# Altium schematic sheet MainBoard_RASP.SchDoc
size 594 x 420 mm; DocumentNumber: VSL.23-MOTHERBOARD; SheetNumber: 2; Format: A2
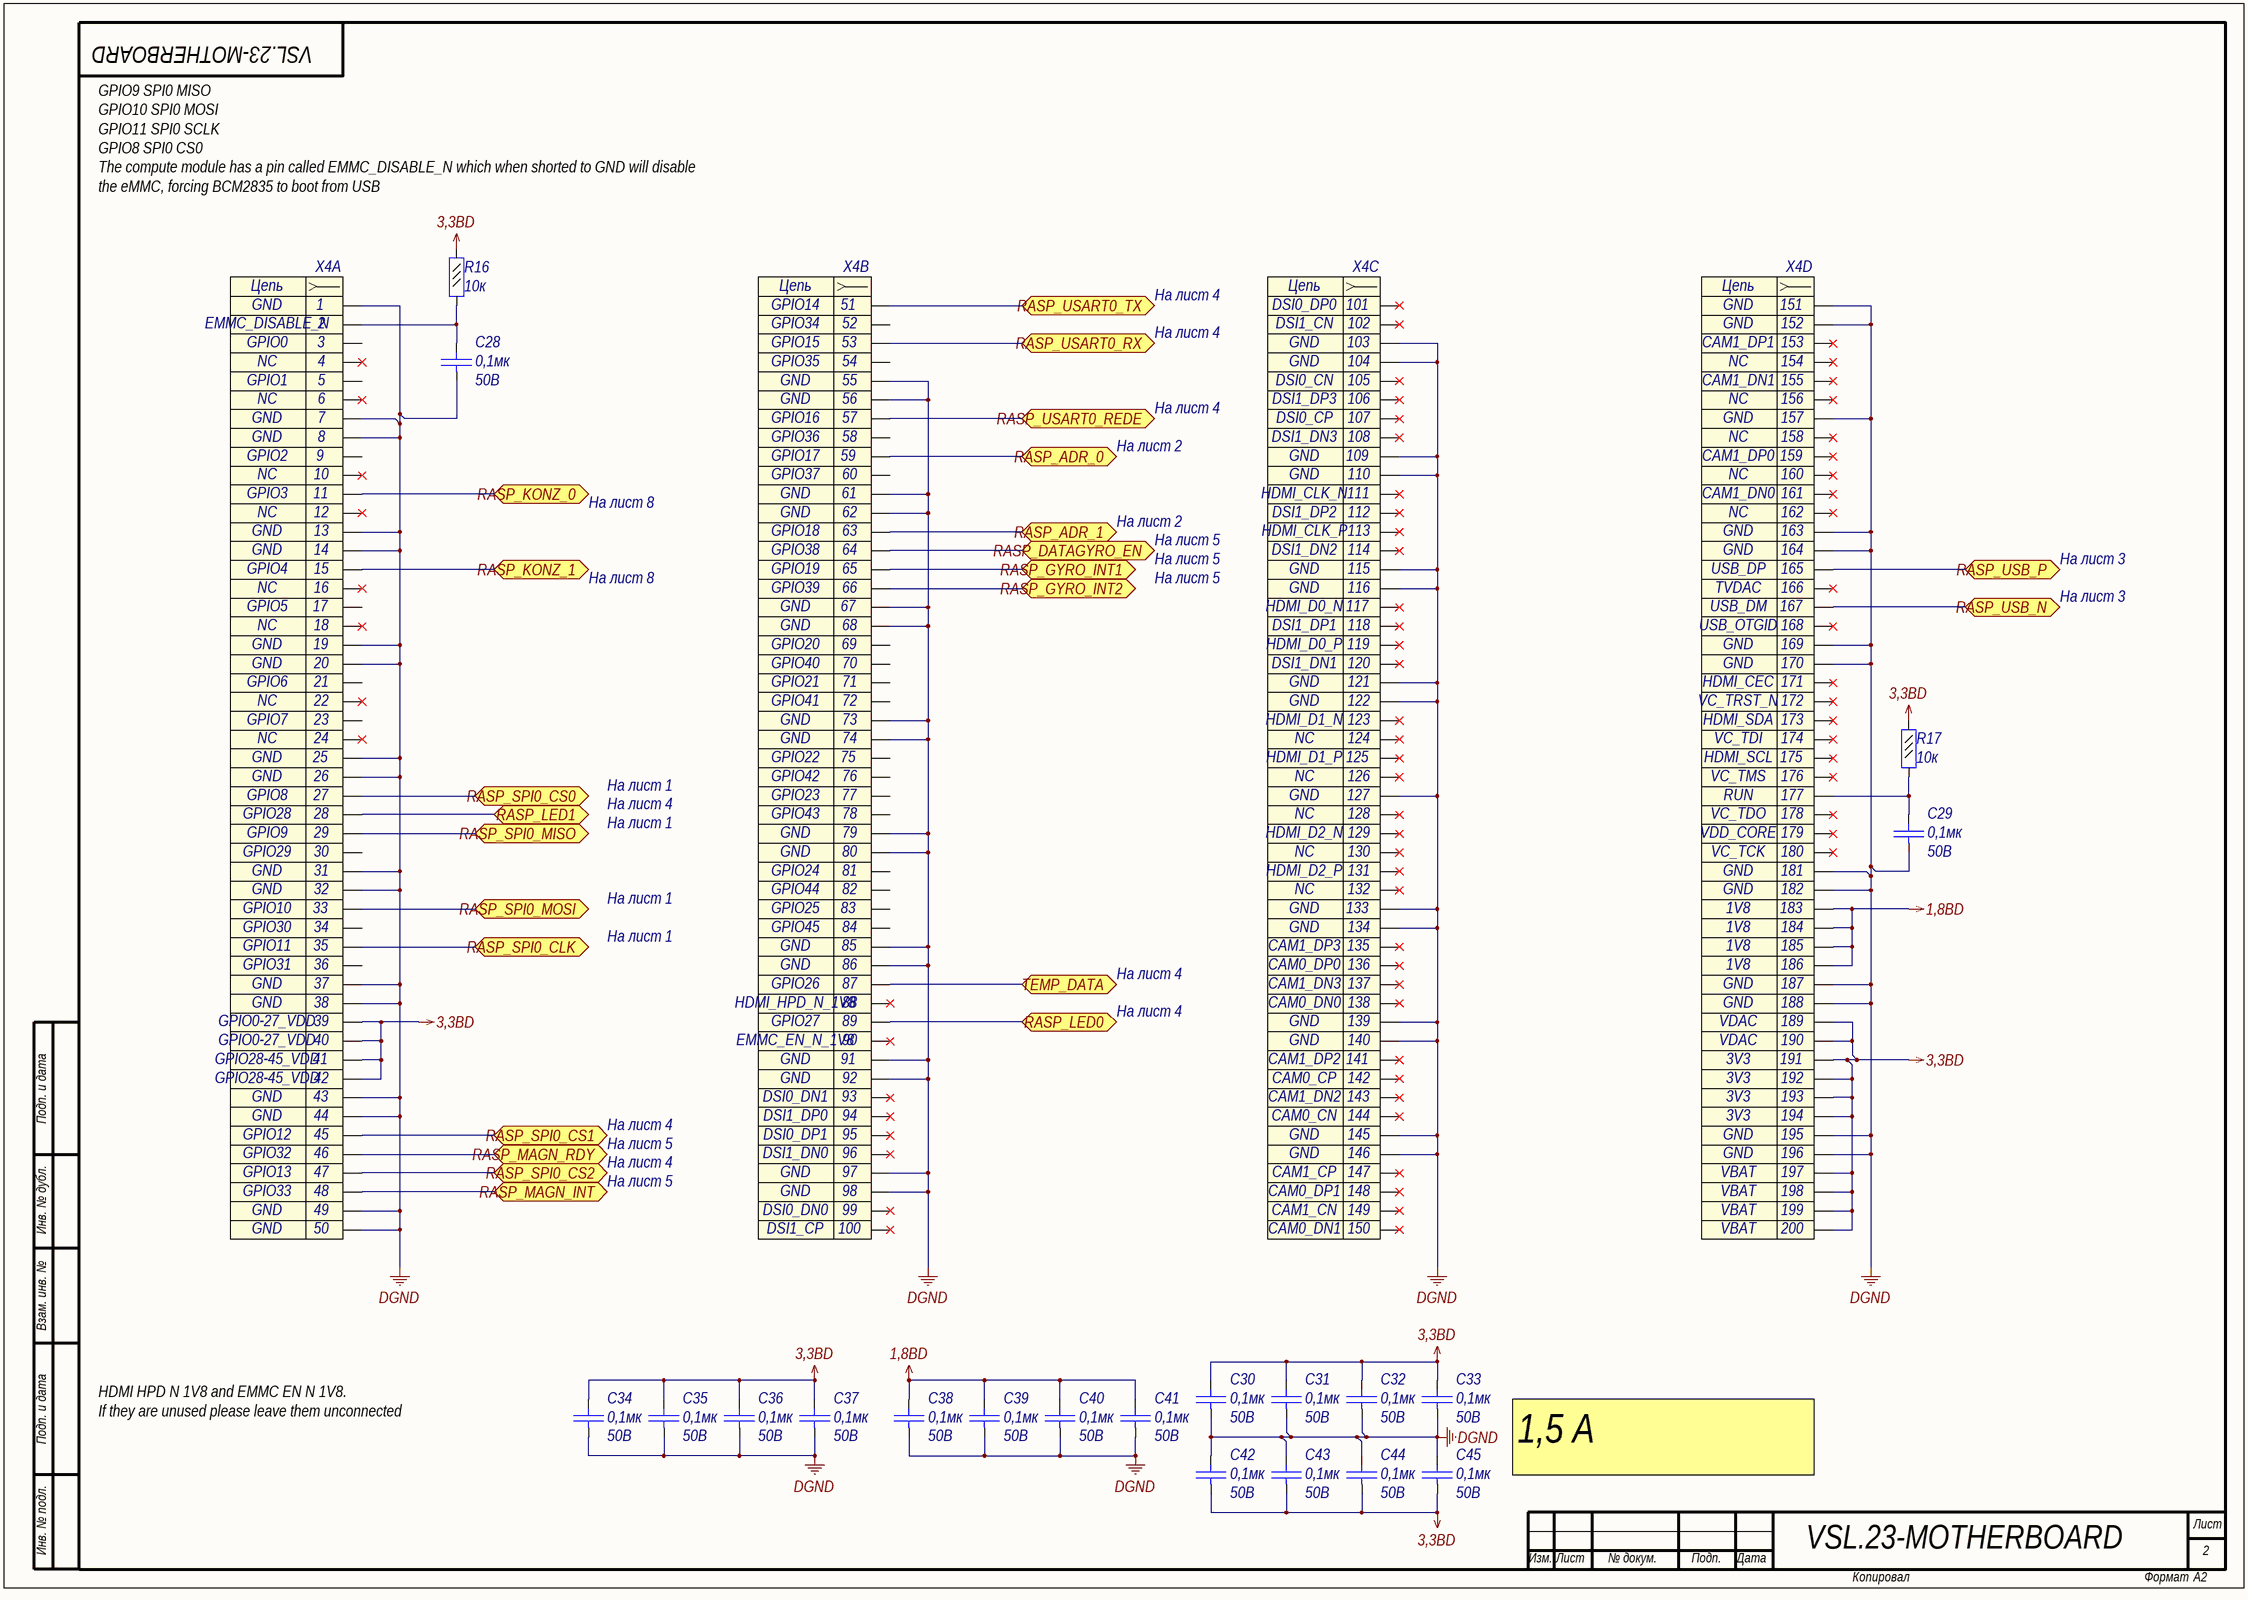
[diagram p0: MainBoard_RASP.SchDoc]

## Parts
C28  value 0,1мк  Voltage: 50B  [C0402]  (hidden comment: Capacitor)
C29  value 0,1мк  Voltage: 50B  [C0402]  (hidden comment: Capacitor)
C30  value 0,1мк  Voltage: 50B  [C0402]  (hidden comment: Capacitor)
C31  value 0,1мк  Voltage: 50B  [C0402]  (hidden comment: Capacitor)
C32  value 0,1мк  Voltage: 50B  [C0402]  (hidden comment: Capacitor)
C33  value 0,1мк  Voltage: 50B  [C0402]  (hidden comment: Capacitor)
C34  value 0,1мк  Voltage: 50B  [C0402]  (hidden comment: Capacitor)
C35  value 0,1мк  Voltage: 50B  [C0402]  (hidden comment: Capacitor)
C36  value 0,1мк  Voltage: 50B  [C0402]  (hidden comment: Capacitor)
C37  value 0,1мк  Voltage: 50B  [C0402]  (hidden comment: Capacitor)
C38  value 0,1мк  Voltage: 50B  [C0402]  (hidden comment: Capacitor)
C39  value 0,1мк  Voltage: 50B  [C0402]  (hidden comment: Capacitor)
C40  value 0,1мк  Voltage: 50B  [C0402]  (hidden comment: Capacitor)
C41  value 0,1мк  Voltage: 50B  [C0402]  (hidden comment: Capacitor)
C42  value 0,1мк  Voltage: 50B  [C0402]  (hidden comment: Capacitor)
C43  value 0,1мк  Voltage: 50B  [C0402]  (hidden comment: Capacitor)
C44  value 0,1мк  Voltage: 50B  [C0402]  (hidden comment: Capacitor)
C45  value 0,1мк  Voltage: 50B  [C0402]  (hidden comment: Capacitor)
R16  value 10к  [R0402]  (hidden comment: Resistor_0,062Вт)
R17  value 10к  [R0402]  (hidden comment: Resistor_0,062Вт)
X4  (no value)  [SODIMM 200P]  (parts A,B,C,D of 4)

## Ports
RASP_ADR_0, RASP_ADR_1, RASP_DATAGYRO_EN, RASP_GYRO_INT1, RASP_GYRO_INT2, RASP_KONZ_0, RASP_KONZ_1, RASP_LED0, RASP_LED1, RASP_MAGN_INT, RASP_MAGN_RDY, RASP_SPI0_CLK, RASP_SPI0_CS0, RASP_SPI0_CS1, RASP_SPI0_CS2, RASP_SPI0_MISO, RASP_SPI0_MOSI, RASP_USART0_REDE, RASP_USART0_RX, RASP_USART0_TX, RASP_USB_N, RASP_USB_P, TEMP_DATA

## Nets
1,8BD: C38.2 C39.2 C40.2 C41.2 X4.183 X4.184 X4.185 X4.186
3,3BD: C30.2 C31.2 C32.2 C33.2 C34.2 C35.2 C36.2 C37.2 C42.1 C43.1 C44.1 C45.1 R16.1 R17.1 X4.39 X4.40 X4.41 X4.42 X4.189 X4.190 X4.191 X4.192 X4.193 X4.194 X4.197 X4.198 X4.199 X4.200
DGND: C28.1 C29.1 C30.1 C31.1 C32.1 C33.1 C34.1 C35.1 C36.1 C37.1 C38.1 C39.1 C40.1 C41.1 C42.2 C43.2 C44.2 C45.2 X4.1 X4.7 X4.8 X4.13 X4.14 X4.19 X4.20 X4.25 X4.26 X4.31 X4.32 X4.37 X4.38 X4.43 X4.44 X4.49 X4.50 X4.55 X4.56 X4.61 X4.62 X4.67 X4.68 X4.73 X4.74 X4.79 X4.80 X4.85 X4.86 X4.91 X4.92 X4.97 X4.98 X4.103 X4.104 X4.109 X4.110 X4.115 X4.116 X4.121 X4.122 X4.127 X4.133 X4.134 X4.139 X4.140 X4.145 X4.146 X4.151 X4.152 X4.157 X4.163 X4.164 X4.169 X4.170 X4.181 X4.182 X4.187 X4.188 X4.195 X4.196
RASP_ADR_0: X4.59 ; port RASP_ADR_0
RASP_ADR_1: X4.63 ; port RASP_ADR_1
RASP_DATAGYRO_EN: X4.64 ; port RASP_DATAGYRO_EN
RASP_GYRO_INT1: X4.65 ; port RASP_GYRO_INT1
RASP_GYRO_INT2: X4.66 ; port RASP_GYRO_INT2
RASP_KONZ_0: X4.11 ; port RASP_KONZ_0
RASP_KONZ_1: X4.15 ; port RASP_KONZ_1
RASP_LED0: X4.89 ; port RASP_LED0
RASP_LED1: X4.28 ; port RASP_LED1
RASP_MAGN_INT: X4.48 ; port RASP_MAGN_INT
RASP_MAGN_RDY: X4.46 ; port RASP_MAGN_RDY
RASP_SPI0_CLK: X4.35 ; port RASP_SPI0_CLK
RASP_SPI0_CS0: X4.27 ; port RASP_SPI0_CS0
RASP_SPI0_CS1: X4.45 ; port RASP_SPI0_CS1
RASP_SPI0_CS2: X4.47 ; port RASP_SPI0_CS2
RASP_SPI0_MISO: X4.29 ; port RASP_SPI0_MISO
RASP_SPI0_MOSI: X4.33 ; port RASP_SPI0_MOSI
RASP_USART0_REDE: X4.57 ; port RASP_USART0_REDE
RASP_USART0_RX: X4.53 ; port RASP_USART0_RX
RASP_USART0_TX: X4.51 ; port RASP_USART0_TX
RASP_USB_N: X4.167 ; port RASP_USB_N
RASP_USB_P: X4.165 ; port RASP_USB_P
TEMP_DATA: X4.87 ; port TEMP_DATA
NetC28_2: C28.2 R16.2 X4.2
NetC29_2: C29.2 R17.2 X4.177

Not connected (* = marked no-connect by the designer): X4 3 4* 5 6* 9 10* 12* 16* 17 18* 21 22* 23 24* 30 34 36 52 54 58 60 69 70 71 72 75 76 77 78 81 82 83 84 88* 90* 93* 94* 95* 96* 99* 100* 101* 102* 105* 106* 107* 108* 111* 112* 113* 114* 117* 118* 119* 120* 123* 124* 125* 126* 128* 129* 130* 131* 132* 135* 136* 137* 138* 141* 142* 143* 144* 147* 148* 149* 150* 153* 154* 155* 156* 158* 159* 160* 161* 162* 166* 168* 171* 172* 173* 174* 175* 176* 178* 179* 180*

## Notes on the sheet
- GPIO9 SPI0 MISO
  GPIO10 SPI0 MOSI
  GPIO11 SPI0 SCLK
  GPIO8 SPI0 CS0
  The compute module has a pin called EMMC_DISABLE_N which when shorted to GND will disable the eMMC, forcing BCM2835 to boot from USB
- На лист 4
- На лист 2
- На лист 8
- На лист 5
- На лист 3
- На лист 1
- Подп. и дата
- Инв. № дубл.
- Взам. инв. №
- HDMI HPD N 1V8 and EMMC EN N 1V8.
  If they are unused please leave them unconnected
- 1,5 А
- Инв. № подл.
- Лист
- Изм.
- № докум.
- Подп.
- Дата
- Копировал
- Формат
- (in symbol connect90, part A) Цепь
- (in symbol connect90, part B) Цепь
- (in symbol connect90, part C) Цепь
- (in symbol connect90, part D) Цепь

## Library data of the parts
C28-C45 = cap131: Конденсатор; Part Name: Ceramic; Manufacture: Murata; Part Number: GRM188R71H104KA93D; id: cap131; TKE: X7R
R16 R17 = res294: Резистор; Manufacture: Yageo; Part Number: RC0402FR-0710KL; id: res294; Accuracy: 0,01; Part Name: Resistor; Power: 0,062Вт
X4 = connect90: Разъем - 5 конт. розетка; Part Name: DDR2 SODIMM connectors; Contact_1: GND; Contact_2: EMMC_DISABLE_N; Contact_3: GPIO0; Contact_4: NC; Contact_5: GPIO1; Contact_9: GPIO2; Contact_11: GPIO3; Contact_15: GPIO4; Contact_17: GPIO5; Contact_21: GPIO6; Contact_23: GPIO7; Contact_27: GPIO8; Contact_28: GPIO28; Contact_29: GPIO9; Contact_30: GPIO29; Contact_33: GPIO10; Contact_34: GPIO30; Contact_35: GPIO11; Contact_36: GPIO31; Contact_39: GPIO0-27_VDD; Contact_41: GPIO28-45_VDD; Contact_45: GPIO12; Contact_46: GPIO32; Contact_47: GPIO13; Contact_48: GPIO33; F81: Contact_75; F82: Contact_76; F83: Contact_77; F84: Contact_78; F85: Contact_79; F86: Contact_80; F87: Contact_81; F88: Contact_82; F89: Contact_83; F90: Contact_84; F91: Contact_85; F92: Contact_86; F93: Contact_87; F94: Contact_88; F95: Contact_89; F96: Contact_90; F97: Contact_91; F98: Contact_92; F99: Contact_93; F100: Contact_94; F101: Contact_95; F102: Contact_96; F103: Contact_97; F104: Contact_98; F105: Contact_99; F106: Contact_100; F107: Contact_101; F108: Contact_102; F109: Contact_103; F110: Contact_104; F111: Contact_105; F112: Contact_106; F113: Contact_107; F114: Contact_108; F115: Contact_109; F116: Contact_110; F117: Contact_111; F118: Contact_112; F119: Contact_113; F120: Contact_114; F121: Contact_115; F122: Contact_116; F123: Contact_117; F124: Contact_118; F125: Contact_119; F126: Contact_120; F127: Contact_121; F128: Contact_122; F129: Contact_123; F130: Contact_124; F131: Contact_125; F132: Contact_126; F133: Contact_127; F134: Contact_128; F135: Contact_129; F136: Contact_130; F137: Contact_131; F138: Contact_132; F139: Contact_133; F140: Contact_134; F141: Contact_135; F142: Contact_136; F143: Contact_137; F144: Contact_138; F145: Contact_139; F146: Contact_140; F147: Contact_141; F148: Contact_142; F149: Contact_143; F150: Contact_144; F151: Contact_145; F152: Contact_146; F153: Contact_147; F154: Contact_148; F155: Contact_149; F156: Contact_150; F157: Contact_151; F158: Contact_152; F159: Contact_153; F160: Contact_154; F161: Contact_155; F162: Contact_156; F163: Contact_157; F164: Contact_158; F165: Contact_159; F166: Contact_160; F167: Contact_161; F168: Contact_162; F169: Contact_163; F170: Contact_164; F171: Contact_165; F172: Contact_166; F173: Contact_167; F174: Contact_168; F175: Contact_169; F176: Contact_170; F177: Contact_171; F178: Contact_172; F179: Contact_173; F180: Contact_174; F181: Contact_175; F182: Contact_176; F183: Contact_177; F184: Contact_178; F185: Contact_179; F186: Contact_180; F187: Contact_181; F188: Contact_182; F189: Contact_183; F190: Contact_184; F191: Contact_185; F192: Contact_186; F193: Contact_187; F194: Contact_188; F195: Contact_189; F196: Contact_190; F197: Contact_191; F198: Contact_192; F199: Contact_193; F200: Contact_194; F201: Contact_195; F202: Contact_196; F203: Contact_197; F204: Contact_198; F205: Contact_199; F206: Contact_200; Contact_6: NC; id: connect90; Contact_7: GND; Contact_8: GND; Contact_10: NC; Contact_12: NC; Contact_13: GND; Contact_14: GND; Contact_16: NC; Contact_18: NC; Contact_19: GND; Contact_20: GND; Contact_22: NC; Contact_24: NC; Contact_25: GND; Contact_26: GND; Contact_31: GND; Contact_32: GND; Contact_37: GND; Contact_38: GND; Contact_40: GPIO0-27_VDD; Contact_42: GPIO28-45_VDD; Contact_43: GND; Contact_44: GND; Contact_49: GND; Contact_50: GND; Contact_51: Contact_51; Contact_52: Contact_52; Contact_53: Contact_53; Contact_54: Contact_54; Contact_55: Contact_55; Contact_56: Contact_56; Contact_57: Contact_57; Contact_58: Contact_58; Contact_59: Contact_59; Contact_60: Contact_60; Contact_61: Contact_61; Contact_62: Contact_62; Contact_63: Contact_63; Contact_64: Contact_64; Contact_65: Contact_65; Contact_66: Contact_66; Contact_67: Contact_67; Contact_68: Contact_68; Contact_69: Contact_69; Contact_70: Contact_70; Contact_71: Contact_71; Contact_73: Contact_73; Contact_72: Contact_72; Contact_74: Contact_74